# Altium schematic sheet bqZUM_Core.SchDoc: bqZUM BT 328
size A4; Author: Raúl de Pablos; CompanyName: bq - Mundo Reader; Organization: bq - Mundo Reader; DocumentNumber: 1; Revision: 2.6; SheetNumber: 1; SheetTotal: 8
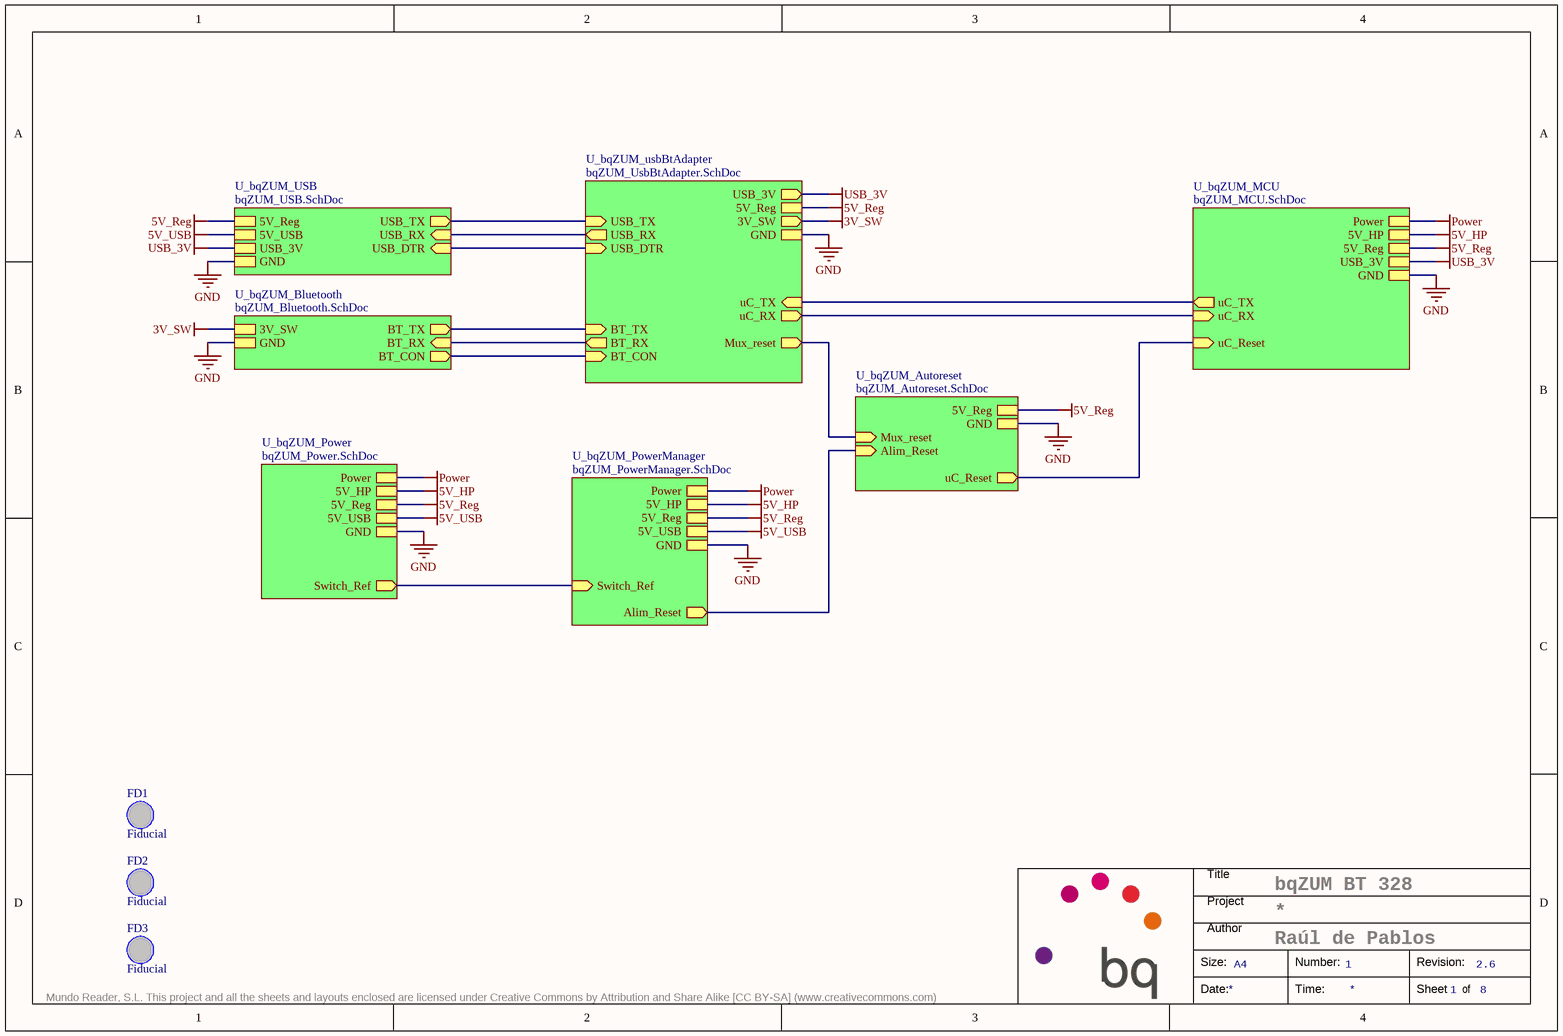
[diagram p0: bqZUM_Core.SchDoc]

## Parts
FD1  Fiducial  [Fiducial]  (no BOM)
FD2  Fiducial  [Fiducial]  (no BOM)
FD3  Fiducial  [Fiducial]  (no BOM)

## Sub-sheets
U_bqZUM_Autoreset = bqZUM_Autoreset.SchDoc: GND, 5V_Reg, Alim_Reset (in), Mux_reset (in), uC_Reset (out)
U_bqZUM_Bluetooth = bqZUM_Bluetooth.SchDoc: 3V_SW, GND, BT_TX (out), BT_RX (in), BT_CON (out)
U_bqZUM_MCU = bqZUM_MCU.SchDoc: uC_RX (in), uC_TX (out), uC_Reset (in), 5V_Reg, 5V_HP, USB_3V, GND, Power
U_bqZUM_Power = bqZUM_Power.SchDoc: 5V_Reg, 5V_HP, GND, Power, Switch_Ref (out), 5V_USB
U_bqZUM_PowerManager = bqZUM_PowerManager.SchDoc: 5V_Reg, 5V_HP, GND, Power, 5V_USB, Alim_Reset (out), Switch_Ref (in)
U_bqZUM_USB = bqZUM_USB.SchDoc: 5V_USB, USB_TX (out), USB_RX (in), USB_DTR (in), USB_3V, GND, 5V_Reg
U_bqZUM_usbBtAdapter = bqZUM_UsbBtAdapter.SchDoc: 5V_Reg, GND, USB_TX (in), USB_RX (out), USB_DTR (in), uC_RX (out), uC_TX (in), Mux_reset (out), BT_RX (out), BT_TX (in), BT_CON (in), USB_3V, 3V_SW

## Nets
3V_SW: sheet U_bqZUM_usbBtAdapter/3V_SW, sheet U_bqZUM_Bluetooth/3V_SW
5V_HP: sheet U_bqZUM_MCU/5V_HP, sheet U_bqZUM_Power/5V_HP, sheet U_bqZUM_PowerManager/5V_HP
5V_Reg: sheet U_bqZUM_MCU/5V_Reg, sheet U_bqZUM_USB/5V_Reg, sheet U_bqZUM_Power/5V_Reg, sheet U_bqZUM_usbBtAdapter/5V_Reg, sheet U_bqZUM_Autoreset/5V_Reg, sheet U_bqZUM_PowerManager/5V_Reg
5V_USB: sheet U_bqZUM_USB/5V_USB, sheet U_bqZUM_Power/5V_USB, sheet U_bqZUM_PowerManager/5V_USB
GND: sheet U_bqZUM_MCU/GND, sheet U_bqZUM_USB/GND, sheet U_bqZUM_Power/GND, sheet U_bqZUM_usbBtAdapter/GND, sheet U_bqZUM_Bluetooth/GND, sheet U_bqZUM_Autoreset/GND, sheet U_bqZUM_PowerManager/GND
Power: sheet U_bqZUM_MCU/Power, sheet U_bqZUM_Power/Power, sheet U_bqZUM_PowerManager/Power
USB_3V: sheet U_bqZUM_MCU/USB_3V, sheet U_bqZUM_USB/USB_3V, sheet U_bqZUM_usbBtAdapter/USB_3V
(unnamed): sheet U_bqZUM_MCU/uC_RX, sheet U_bqZUM_usbBtAdapter/uC_RX
(unnamed): sheet U_bqZUM_MCU/uC_TX, sheet U_bqZUM_usbBtAdapter/uC_TX
(unnamed): sheet U_bqZUM_MCU/uC_Reset, sheet U_bqZUM_Autoreset/uC_Reset
(unnamed): sheet U_bqZUM_USB/USB_TX, sheet U_bqZUM_usbBtAdapter/USB_TX
(unnamed): sheet U_bqZUM_USB/USB_RX, sheet U_bqZUM_usbBtAdapter/USB_RX
(unnamed): sheet U_bqZUM_USB/USB_DTR, sheet U_bqZUM_usbBtAdapter/USB_DTR
(unnamed): sheet U_bqZUM_Power/Switch_Ref, sheet U_bqZUM_PowerManager/Switch_Ref
(unnamed): sheet U_bqZUM_usbBtAdapter/Mux_reset, sheet U_bqZUM_Autoreset/Mux_reset
(unnamed): sheet U_bqZUM_usbBtAdapter/BT_RX, sheet U_bqZUM_Bluetooth/BT_RX
(unnamed): sheet U_bqZUM_usbBtAdapter/BT_TX, sheet U_bqZUM_Bluetooth/BT_TX
(unnamed): sheet U_bqZUM_usbBtAdapter/BT_CON, sheet U_bqZUM_Bluetooth/BT_CON
(unnamed): sheet U_bqZUM_Autoreset/Alim_Reset, sheet U_bqZUM_PowerManager/Alim_Reset

## Notes on the sheet
- Title
- Project
- Size:
- Author
- A4
- Number:
- Revision:
- Mundo Reader, S.L. This project and all the sheets and layouts enclosed are licensed under Creative Commons by Attribution and Share Alike [CC BY-SA] (www.creativecommons.com)
- Date:
- Time:
- Sheet
- of

## Library data of the parts
FD1-FD3 = Fiducial: Part Number: Fiducial